# Altium schematic sheet sch_Connet&IMU.SchDoc
size A4
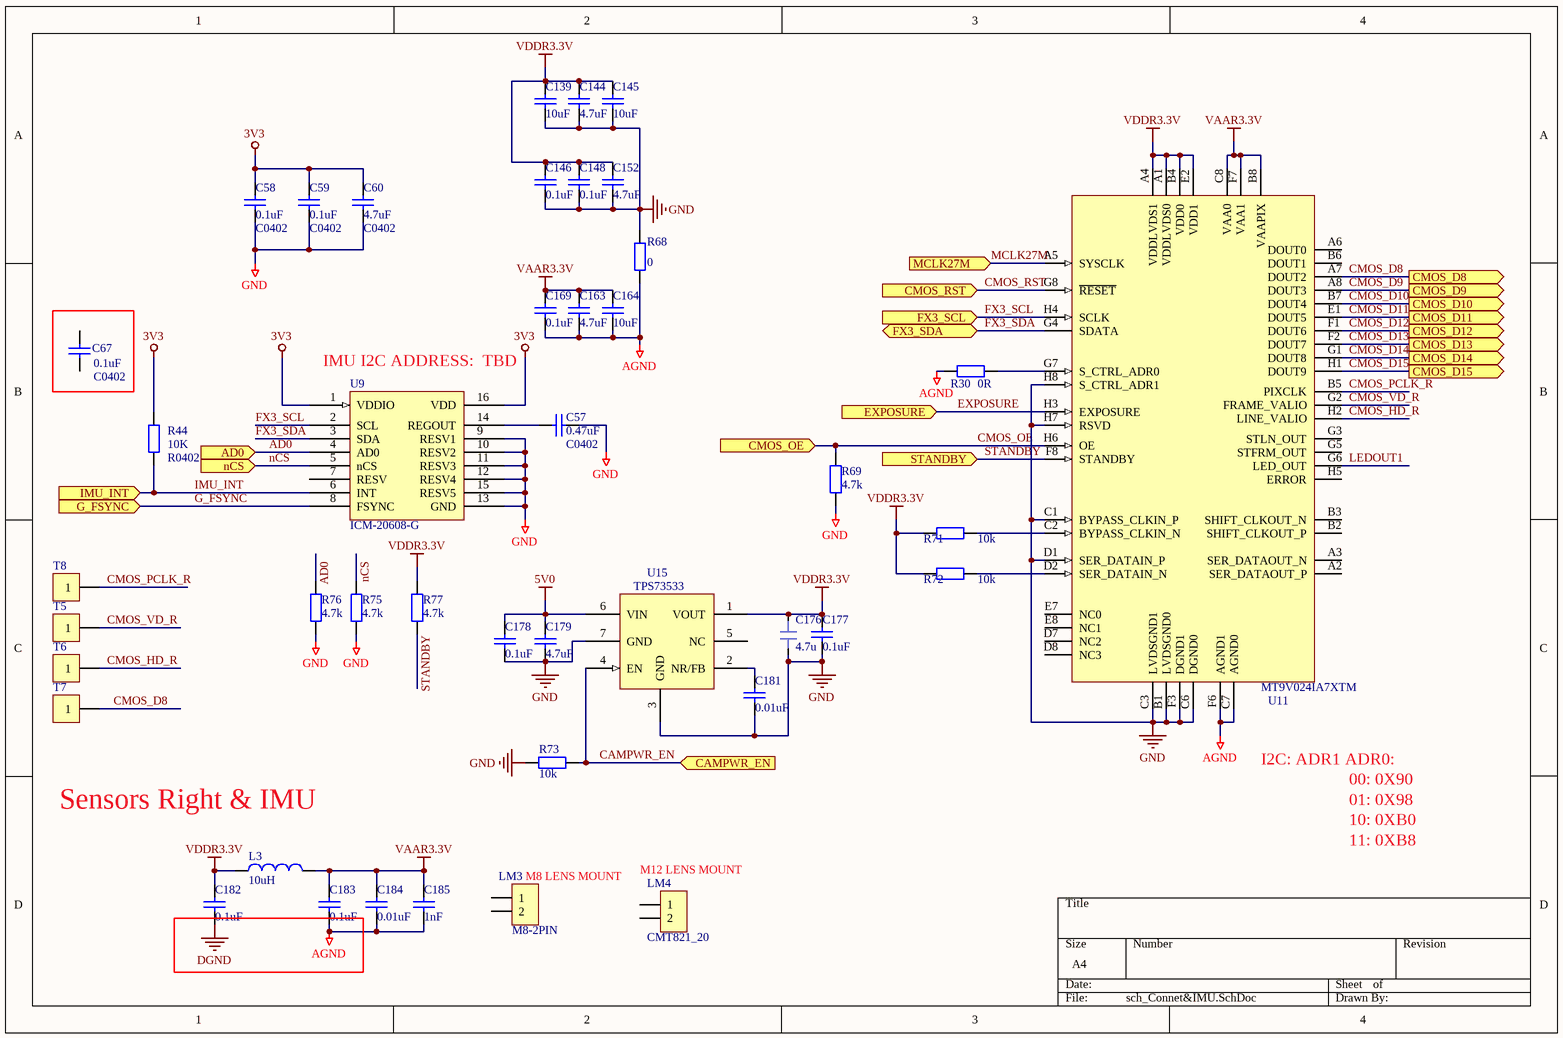
[diagram p0: sch_Connet&IMU.SchDoc]

## Parts
C57  0.47uF  value C0402  [0402C]
C58  0.1uF  value C0402  [0402C]
C59  0.1uF  value C0402  [0402C]
C60  4.7uF  value C0402  [0402C]
C67  0.1uF  value C0402  [0402C]
C139  10uF  [0805C]
C144  4.7uF  [0402C]
C145  10uF  [0805C]
C146  0.1uF  [0402C]
C148  0.1uF  [0402C]
C152  4.7uF  [0402C]
C163  4.7uF  [0402C]
C164  10uF  [0805C]
C169  0.1uF  [0402C]
C176  4.7u  [0402C_L]
C177  0.1uF  [0402C_L]
C178  0.1uF  [0402C]
C179  4.7uF  [0402C_L]
C181  0.01uF  [0402C_L]
C182  0.1uF  [0402C_L]
C183  0.1uF  [0402C_L]
C184  0.01uF  [0402C_L]
C185  1nF  [0402C_L]
L3  10uH  [0805R]
LM3  M8-2PIN  [PAD_M3_D350_450]
LM4  CMT821_20  [PAD_M3_D350_450]
R30  0R  [0402R]
R44  10K  value R0402  [0402R]
R68  value 0  [0402R]  (hidden comment: 0R)
R69  4.7K  [0402R_L]
R71  10K  [0402R]
R72  10K  [0402R]
R73  10K  [0402R_L]
R75  4.7K  [0402R]
R76  4.7K  [0402R]
R77  4.7K  [0402R]
T5  CON1  [PAD_TP_D1.2]  (value not drawn)
T6  CON1  [PAD_TP_D1.2]  (value not drawn)
T7  CON1  [PAD_TP_D1.2]  (value not drawn)
T8  CON1  [PAD_TP_D1.2]  (value not drawn)
U9  ICM-20608-G  [LGA16_P50L30W30H08]
U11  MT9V024IA7XTM  [IBGA52_8X8_P100L90W90H90R]
U15  TPS73533  [SON6_P65L21W21H8_DRV]

## Ports
AD0 (in), CAMPWR_EN (in), CMOS_D8 (out), CMOS_D9 (out), CMOS_D10 (out), CMOS_D11 (out), CMOS_D12 (out), CMOS_D13 (out), CMOS_D14 (out), CMOS_D15 (out), CMOS_OE (in), CMOS_RST (in), EXPOSURE (in), FX3_SCL (in), FX3_SDA (bidir), G_FSYNC (in), IMU_INT (in), MCLK27M (in), nCS (in), STANDBY (in)

## Nets
3V3: C58.2 C59.2 C60.2 R44.2 U9.1(VDDIO) U9.16(VDD)
5V0: C178.2 C179.2 U15.6(VIN)
AGND: C163.1 C164.1 C169.1 C183.1 C184.1 C185.1 R30.2 R68.2 U11.C7(AGND0) U11.F6(AGND1)
DGND: C182.1
GND: C57.1 C58.1 C59.1 C60.1 C139.1 C144.1 C145.1 C146.1 C148.1 C152.1 C176.2 C177.1 C178.1 C179.1 C181.1 R68.1 R69.1 R73.1 R75.1 R76.1 U9.9(RESV1) U9.10(RESV2) U9.11(RESV3) U9.12(RESV4) U9.13(GND) U9.15(RESV5) U11.B1(LVDSGND0) U11.C1(BYPASS_CLKIN_P) U11.C3(LVDSGND1) U11.C6(DGND0) U11.D1(SER_DATAIN_P) U11.F3(DGND1) U11.H7(RSVD) U11.H8(S_CTRL_ADR1) U15.3(GND) U15.7(GND)
VAAR3.3V: C163.2 C164.2 C169.2 C183.2 C184.2 C185.2 L3.2 U11.B8(VAAPIX) U11.C8(VAA0) U11.F7(VAA1)
VDDR3.3V: C139.2 C144.2 C145.2 C146.2 C148.2 C152.2 C176.1 C177.2 C182.2 L3.1 R71.2 R72.2 R77.2 U11.A1(VDDLVDS0) U11.A4(VDDLVDS1) U11.B4(VDD0) U11.E2(VDD1) U15.1(VOUT)
AD0: R76.2 U9.4(AD0) ; port AD0
CAMPWR_EN: R73.2 U15.4(EN) ; port CAMPWR_EN
CMOS_D8: T7.1 U11.A7(DOUT2) ; port CMOS_D8
CMOS_D9: U11.A8(DOUT3) ; port CMOS_D9
CMOS_D10: U11.B7(DOUT4) ; port CMOS_D10
CMOS_D11: U11.E1(DOUT5) ; port CMOS_D11
CMOS_D12: U11.F1(DOUT6) ; port CMOS_D12
CMOS_D13: U11.F2(DOUT7) ; port CMOS_D13
CMOS_D14: U11.G1(DOUT8) ; port CMOS_D14
CMOS_D15: U11.H1(DOUT9) ; port CMOS_D15
CMOS_HD_R: T6.1 U11.H2(LINE_VALIO)
CMOS_OE: R69.2 U11.H6(OE) ; port CMOS_OE
CMOS_PCLK_R: T8.1 U11.B5(PIXCLK)
CMOS_RST: U11.G8(~{RESET}) ; port CMOS_RST
CMOS_VD_R: T5.1 U11.G2(FRAME_VALIO)
EXPOSURE: U11.H3(EXPOSURE) ; port EXPOSURE
FX3_SCL: U9.2(SCL) U11.H4(SCLK) ; port FX3_SCL
FX3_SDA: U9.3(SDA) U11.G4(SDATA) ; port FX3_SDA
G_FSYNC: U9.8(FSYNC) ; port G_FSYNC
IMU_INT: R44.1 U9.6(INT) ; port IMU_INT
LEDOUT1: U11.G6(LED_OUT)
MCLK27M: U11.A5(SYSCLK) ; port MCLK27M
nCS: R75.2 U9.5(nCS) ; port nCS
STANDBY: R77.1 U11.F8(STANDBY) ; port STANDBY
NetC57_2: C57.2 U9.14(REGOUT)
NetC181_2: C181.2 U15.2(NR/FB)
NetR30_1: R30.1 U11.G7(S_CTRL_ADR0)
NetR71_1: R71.1 U11.C2(BYPASS_CLKIN_N)
NetR72_1: R72.1 U11.D2(SER_DATAIN_N)

Not connected (* = marked no-connect by the designer): C67 1 2; LM3 1 2; LM4 1 2; U9 7(RESV); U11 A2(SER_DATAOUT_P) A3(SER_DATAOUT_N) A6(DOUT0) B2(SHIFT_CLKOUT_P) B3(SHIFT_CLKOUT_N) B6(DOUT1) D7(NC2) D8(NC3) E7(NC0) E8(NC1) G3(STLN_OUT) G5(STFRM_OUT) H5(ERROR); U15 5(NC)

## Notes on the sheet
- (near U9) IMU I2C ADDRESS:  TBD
- I2C: ADR1 ADR0:
- 00: 0X90
- Sensors Right & IMU
- 01: 0X98
- 10: 0XB0
- 11: 0XB8
- (near LM3) M8 LENS MOUNT
- (near LM4) M12 LENS MOUNT

## Library data of the parts
C57-C60 C67 C139 C144-C146 C148 C152 C163 C164 C169 C177-C179 C181-C185 = Cap: Capacitor; Published: 8-Jun-2000; LatestRevisionDate: 17-Jul-2002; LatestRevisionNote: Re-released for DXP Platform.; Publisher: Altium Limited
  C57-C60 C67: PackageReference: RAD-0.3
  C139 C145 C164: PackageReference: RAD-0.3; Value: 10uF
  C144 C152 C163 C179: PackageReference: RAD-0.3; Value: 4.7uF
  C146 C148 C169 C177 C178 C182 C183: Value: 0.1uF
  C181: PackageReference: RAD-0.3; Value: 0.01uF
  C184: Value: 0.01uF
  C185: Value: 1nF
C176 = cap0402: CC0402MRX5R5BB475; 元件类别: 贴片电容; 主物料厂家: YAGEO
L3 = Inductor: Value: 330mH
LM3 LM4 = CON2: Connector
R30 R44 = Res2: Resistor; Published: 8-Jun-2000; LatestRevisionDate: 17-Jul-2002; LatestRevisionNote: Re-released for DXP Platform.; PackageReference: AXIAL-0.4; Publisher: Altium Limited
  R30: Value: 0R
R68 R69 R71-R73 R75-R77 = Resistor: Published: 8-Jun-2000; LatestRevisionDate: 17-Jul-2002; LatestRevisionNote: Re-released for DXP Platform.; PackageReference: AXIAL-0.4; Publisher: Altium Limited
  R69 R75-R77: Value: 4.7k
  R71-R73: Value: 10k
T5-T8 = CON1: Connector